# EAGLE design acnode (EAGLE 6.4)

## Sheet 1 of 3
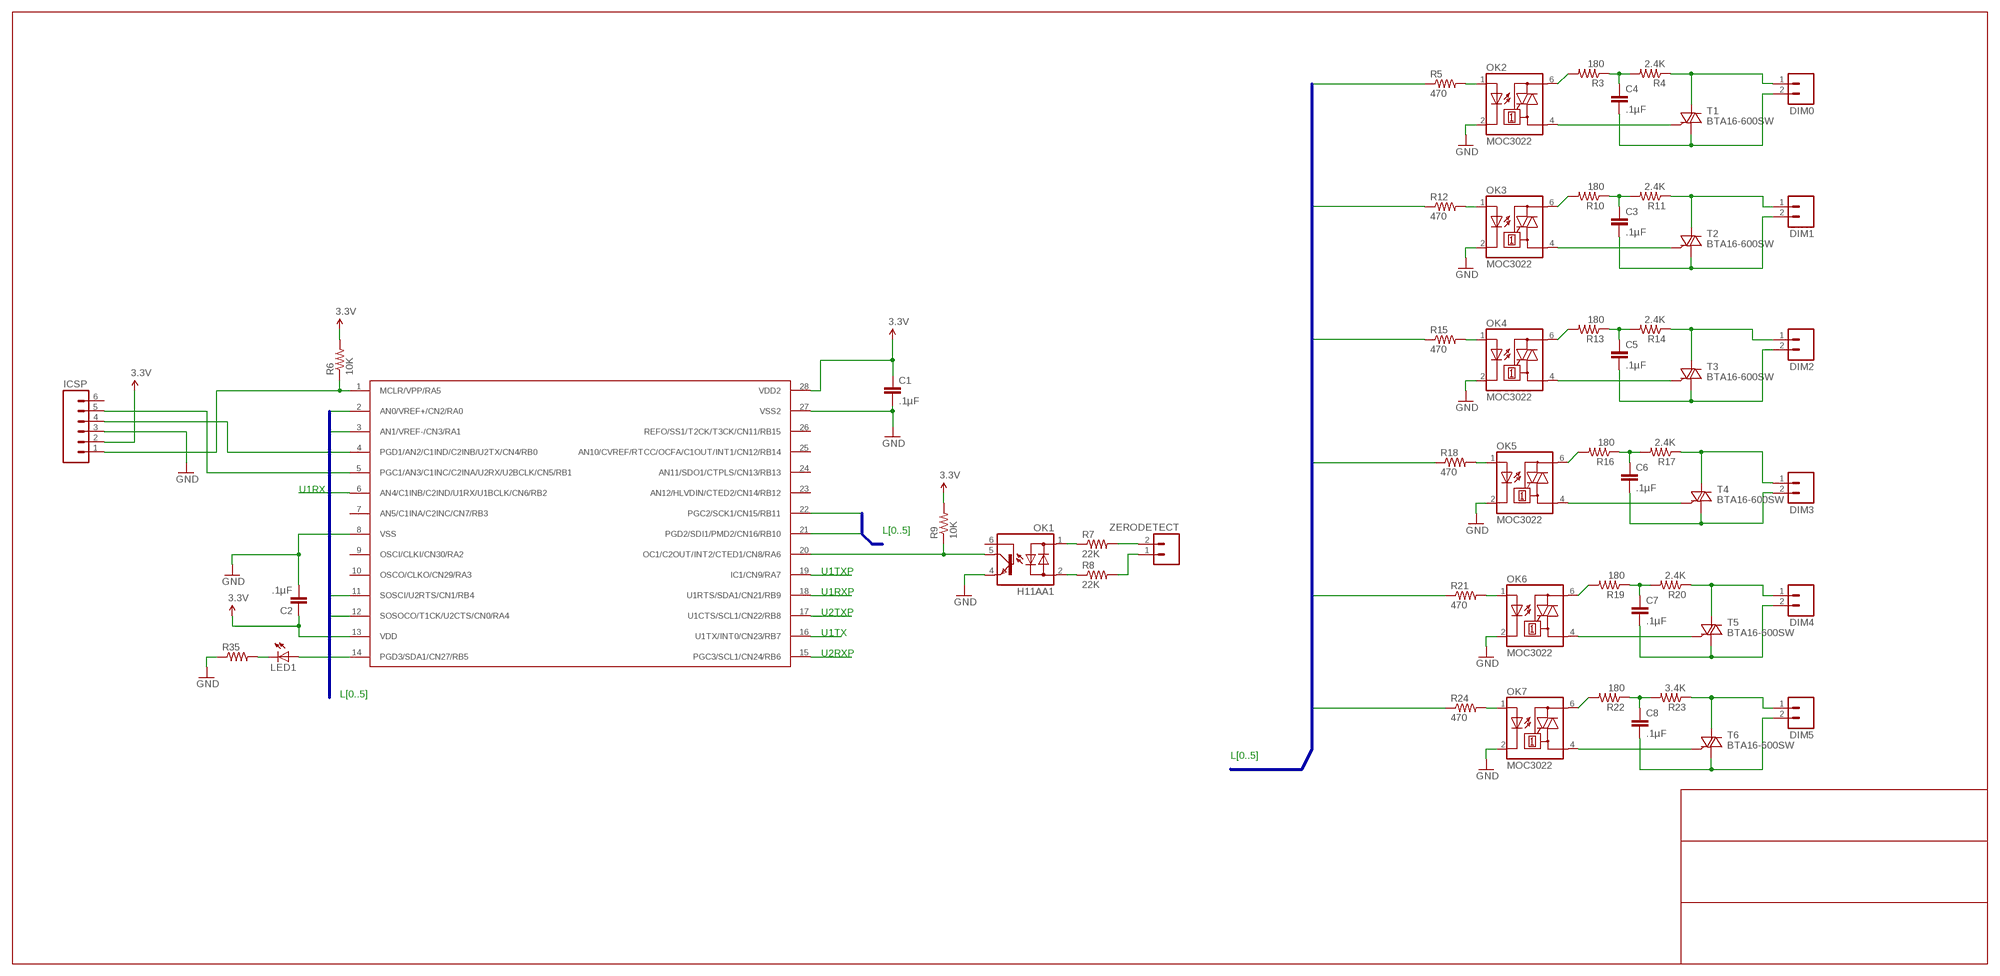
[diagram p0: schematic, sheet 1]

### Parts
C1  .1µF  CAP1206  [1206]
C2  .1µF  CAP1206  [1206]
C3  .1µF  CAPPTH1  [CAP-PTH-5MM]
C4  .1µF  CAPPTH1  [CAP-PTH-5MM]
C5  .1µF  CAPPTH1  [CAP-PTH-5MM]
C6  .1µF  CAPPTH1  [CAP-PTH-5MM]
C7  .1µF  CAPPTH1  [CAP-PTH-5MM]
C8  .1µF  CAPPTH1  [CAP-PTH-5MM]
DIM0  M025MM  [SCREWTERMINAL-5MM-2]
DIM1  M025MM  [SCREWTERMINAL-5MM-2]
DIM2  M025MM  [SCREWTERMINAL-5MM-2]
DIM3  M025MM  [SCREWTERMINAL-5MM-2]
DIM4  M025MM  [SCREWTERMINAL-5MM-2]
DIM5  M025MM  [SCREWTERMINAL-5MM-2]
ICSP  M06LOCK  [1X06_LOCK]
LED1  LEDCHIPLED_1206  [CHIPLED_1206]
OK1  H11AA1  IL250  [DIL06]
OK2  MOC3022  IL410  [DIL06]
OK3  MOC3022  IL410  [DIL06]
OK4  MOC3022  IL410  [DIL06]
OK5  MOC3022  IL410  [DIL06]
OK6  MOC3022  IL410  [DIL06]
OK7  MOC3022  IL410  [DIL06]
R3  180  RESISTORPTH-1/4W  [AXIAL-0.4]
R4  2.4K  RESISTORPTH-1/4W  [AXIAL-0.4]
R5  470  RESISTOR1206  [1206]
R6  10K  RESISTOR1206  [1206]
R7  22K  RESISTORPTH-1/4W  [AXIAL-0.4]
R8  22K  RESISTORPTH-1/4W  [AXIAL-0.4]
R9  10K  RESISTOR1206  [1206]
R10  180  RESISTORPTH-1/4W  [AXIAL-0.4]
R11  2.4K  RESISTORPTH-1/4W  [AXIAL-0.4]
R12  470  RESISTOR1206  [1206]
R13  180  RESISTORPTH-1/4W  [AXIAL-0.4]
R14  2.4K  RESISTORPTH-1/4W  [AXIAL-0.4]
R15  470  RESISTOR1206  [1206]
R16  180  RESISTORPTH-1/4W  [AXIAL-0.4]
R17  2.4K  RESISTORPTH-1/4W  [AXIAL-0.4]
R18  470  RESISTOR1206  [1206]
R19  180  RESISTORPTH-1/4W  [AXIAL-0.4]
R20  2.4K  RESISTORPTH-1/4W  [AXIAL-0.4]
R21  470  RESISTOR1206  [1206]
R22  180  RESISTORPTH-1/4W  [AXIAL-0.4]
R23  3.4K  RESISTORPTH-1/4W  [AXIAL-0.4]
R24  470  RESISTOR1206  [1206]
R35  RESISTOR1206  [1206]
T1  BTA16-600SW  BT138-V  [TO220BV]
T2  BTA16-600SW  BT138-V  [TO220BV]
T3  BTA16-600SW  BT138-V  [TO220BV]
T4  BTA16-600SW  BT138-V  [TO220BV]
T5  BTA16-600SW  BT138-V  [TO220BV]
T6  BTA16-600SW  BT138-V  [TO220BV]
U$2  PIC24F16KA102  PIC24F16KA102SSOP28DB  [SSOP28DB]
ZERODETECT  M025MM  [SCREWTERMINAL-5MM-2]

### Nets
3.3V: C1.1 C2.1 ICSP.2 R6.2 R9.2 U$2.13(VDD) U$2.28(VDD2) ; also sheet 3
GND: C1.2 C2.2 ICSP.3 OK1.4(E) OK2.2(C) OK3.2(C) OK4.2(C) OK5.2(C) OK6.2(C) OK7.2(C) R35.1 U$2.8(VSS) U$2.27(VSS2) ; also sheet 2,3
L0: R5.1 U$2.2(AN0/VREF+/CN2/RA0)
L1: R12.1 U$2.3(AN1/VREF-/CN3/RA1)
L2: R15.1 U$2.22(PGC2/SCK1/CN15/RB11)
L3: R18.1 U$2.21(PGD2/SDI1/PMD2/CN16/RB10)
L4: R21.1 U$2.11(SOSCI/U2RTS/CN1/RB4)
L5: R24.1 U$2.12(SOSOCO/T1CK/U2CTS/CN0/RA4)
N$1: LED1.A U$2.14(PGD3/SDA1/CN27/RB5)
N$2: OK3.4(A1) T2.G
N$3: ICSP.1 R6.1 U$2.1(MCLR/VPP/RA5)
N$4: LED1.C R35.2
N$9: OK2.4(A1) T1.G
N$10: OK2.6(A2) R3.P$2
N$11: C4.1 R3.P$1 R4.P$2
N$12 [power]: C4.2 DIM0.2 T1.T1(A1)
N$13 [power]: DIM0.1 R4.P$1 T1.T2(A2)
N$14: OK2.1(A) R5.2
N$17: OK1.1(AC1) R7.P$1
N$18: OK1.2(AC2) R8.P$1
N$19: OK1.5(C) R9.1 U$2.20(OC1/C2OUT/INT2/CTED1/CN8/RA6)
N$20: OK3.6(A2) R10.P$2
N$21: C3.1 R10.P$1 R11.P$2
N$22 [power]: C3.2 DIM1.2 T2.T1(A1)
N$23 [power]: DIM1.1 R11.P$1 T2.T2(A2)
N$24: OK3.1(A) R12.2
N$25: OK4.4(A1) T3.G
N$26: OK4.6(A2) R13.P$2
N$27: C5.1 R13.P$1 R14.P$2
N$28 [power]: C5.2 DIM2.2 T3.T1(A1)
N$29 [power]: DIM2.1 R14.P$1 T3.T2(A2)
N$30: OK4.1(A) R15.2
N$31: OK5.4(A1) T4.G
N$32: OK5.6(A2) R16.P$2
N$33: C6.1 R16.P$1 R17.P$2
N$34 [power]: C6.2 DIM3.2 T4.T1(A1)
N$35 [power]: DIM3.1 R17.P$1 T4.T2(A2)
N$36: OK5.1(A) R18.2
N$37: OK6.4(A1) T5.G
N$38: OK6.6(A2) R19.P$2
N$39: C7.1 R19.P$1 R20.P$2
N$40 [power]: C7.2 DIM4.2 T5.T1(A1)
N$41 [power]: DIM4.1 R20.P$1 T5.T2(A2)
N$42: OK6.1(A) R21.2
N$43: OK7.4(A1) T6.G
N$44: OK7.6(A2) R22.P$2
N$45: C8.1 R22.P$1 R23.P$2
N$46 [power]: C8.2 DIM5.2 T6.T1(A1)
N$47 [power]: DIM5.1 R23.P$1 T6.T2(A2)
N$48: OK7.1(A) R24.2
N$49: R7.P$2 ZERODETECT.2
N$50: R8.P$2 ZERODETECT.1
U1RX: U$2.6(AN4/C1INB/C2IND/U1RX/U1BCLK/CN6/RB2) ; also sheet 2
U1RXP: U$2.18(U1RTS/SDA1/CN21/RB9) ; also sheet 2
U1TX: U$2.16(U1TX/INT0/CN23/RB7) ; also sheet 2
U1TXP: U$2.19(IC1/CN9/RA7) ; also sheet 2
U2RX: ICSP.5 U$2.5(PGC1/AN3/C1INC/C2INA/U2RX/U2BCLK/CN5/RB1) ; also sheet 2
U2RXP: U$2.15(PGC3/SCL1/CN24/RB6) ; also sheet 2
U2TX: ICSP.4 U$2.4(PGD1/AN2/C1IND/C2INB/U2TX/CN4/RB0) ; also sheet 2
U2TXP: U$2.17(U1CTS/SCL1/CN22/RB8) ; also sheet 2
Unconnected: ICSP.6 OK1.6(B) U$2.7(AN5/C1INA/C2INC/CN7/RB3) U$2.9(OSCI/CLKI/CN30/RA2) U$2.10(OSCO/CLKO/CN29/RA3) U$2.23(AN12/HLVDIN/CTED2/CN14/RB12) U$2.24(AN11/SDO1/CTPLS/CN13/RB13) U$2.25(AN10/CVREF/RTCC/OCFA/C1OUT/INT1/CN12/RB14) U$2.26(REFO/SS1/T2CK/T3CK/CN11/RB15)

### Buses
L[0..5]

### Notes on the sheet
- U1RX
- L[0..5]
- U1TXP
- U1RXP
- U2TXP
- U1TX
- U2RXP
- L[0..5]
- L[0..5]

## Sheet 2 of 3
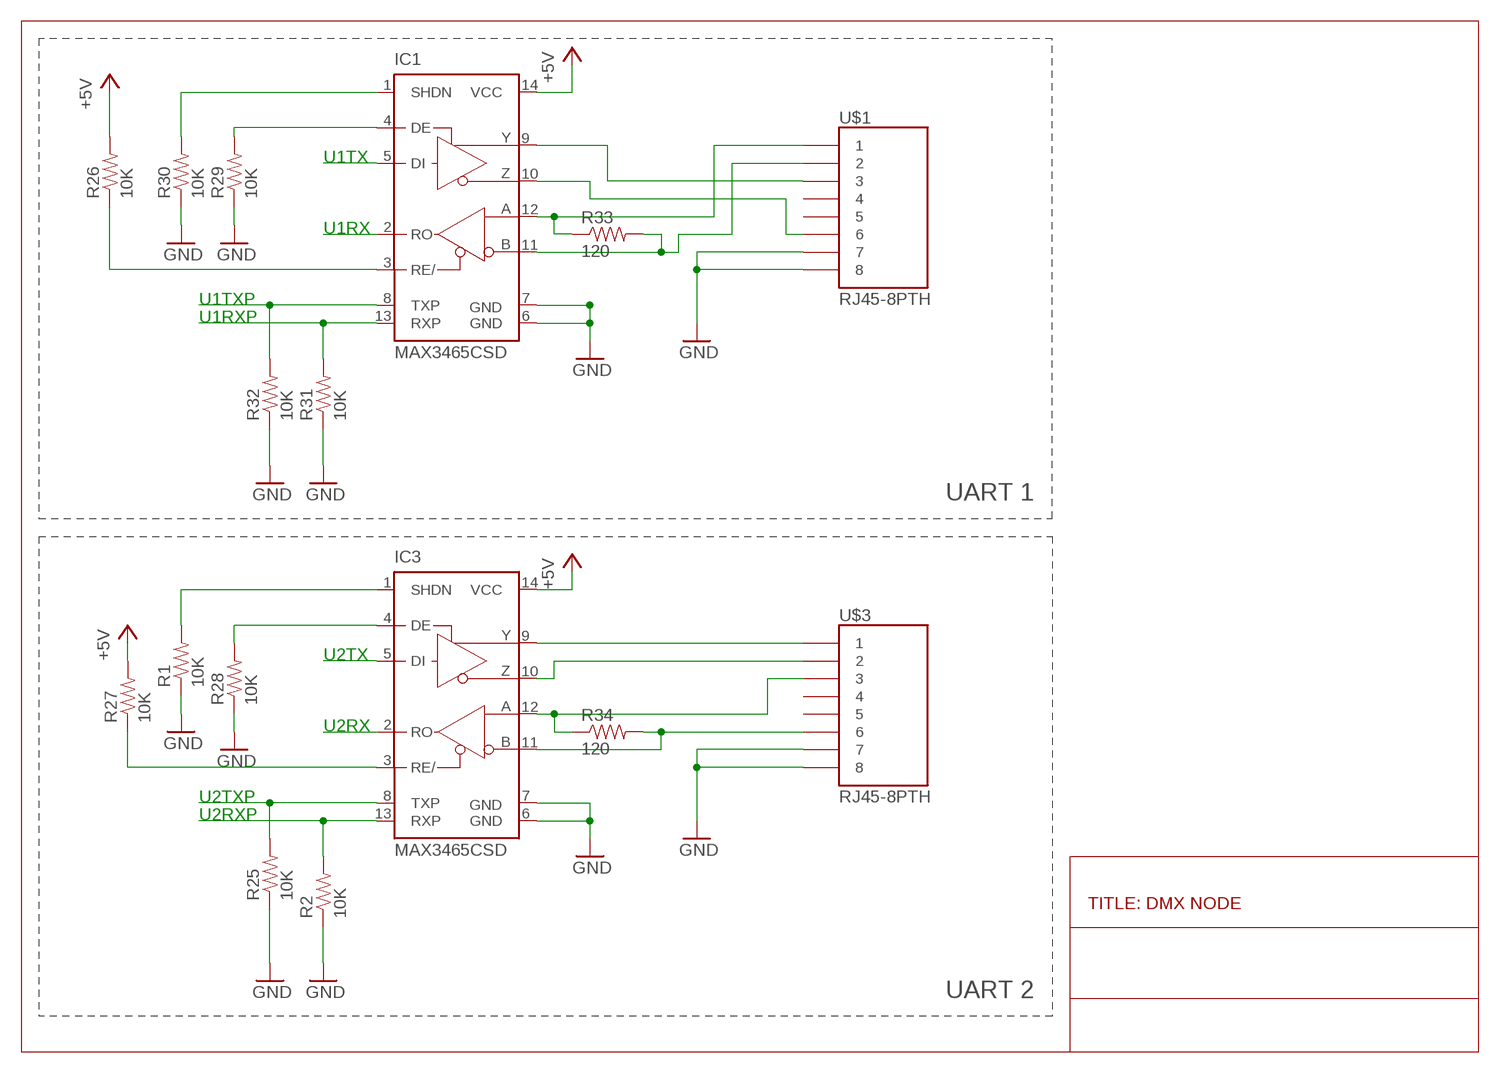
[diagram p1: schematic, sheet 2]

### Parts
IC1  MAX3465CSD  [SO14]
IC3  MAX3465CSD  [SO14]
R1  10K  RESISTOR1206  [1206]
R2  10K  RESISTOR1206  [1206]
R25  10K  RESISTOR1206  [1206]
R26  10K  RESISTOR1206  [1206]
R27  10K  RESISTOR1206  [1206]
R28  10K  RESISTOR1206  [1206]
R29  10K  RESISTOR1206  [1206]
R30  10K  RESISTOR1206  [1206]
R31  10K  RESISTOR1206  [1206]
R32  10K  RESISTOR1206  [1206]
R33  120  RESISTOR1206  [1206]
R34  120  RESISTOR1206  [1206]
U$1  RJ45-8PTH  [RJ45-8]
U$3  RJ45-8PTH  [RJ45-8]

### Nets
2A: IC3.12(A) R34.1 U$3.3
2A1: IC1.12(A) R33.1 U$1.1
2B: IC3.11(B) R34.2 U$3.6
2B1: IC1.11(B) R33.2 U$1.2
2Y: IC3.9(Y) U$3.1
2Y1: IC1.9(Y) U$1.3
2Z: IC3.10(Z) U$3.2
+5V: IC1.14(VCC) IC3.14(VCC) R26.2 R27.2 ; also sheet 3
GND: IC1.6(GND) IC1.7(GND) IC3.6(GND) IC3.7(GND) R1.1 R2.1 R25.1 R28.1 R29.1 R30.1 R31.1 R32.1 U$1.7 U$1.8 U$3.7 U$3.8 ; also sheet 1,3
N$6: IC3.1(SHDN) R1.2
N$8: IC1.4(DE) R29.2
N$15: IC1.3(RE/) R26.1
N$16: IC1.1(SHDN) R30.2
N$52: IC1.10(Z) U$1.6
N$59: IC3.4(DE) R28.2
N$60: IC3.3(RE/) R27.1
U1RX: IC1.2(RO) ; also sheet 1
U1RXP: IC1.13(RXP) R31.2 ; also sheet 1
U1TX: IC1.5(DI) ; also sheet 1
U1TXP: IC1.8(TXP) R32.2 ; also sheet 1
U2RX: IC3.2(RO) ; also sheet 1
U2RXP: IC3.13(RXP) R2.2 ; also sheet 1
U2TX: IC3.5(DI) ; also sheet 1
U2TXP: IC3.8(TXP) R25.2 ; also sheet 1
Unconnected: U$1.4 U$1.5 U$3.4 U$3.5

### Notes on the sheet
- U1TX
- U1RX
- U1TXP
- U1RXP
- UART 1
- U2TX
- U2RX
- U2TXP
- U2RXP
- TITLE: DMX NODE
- UART 2

## Sheet 3 of 3
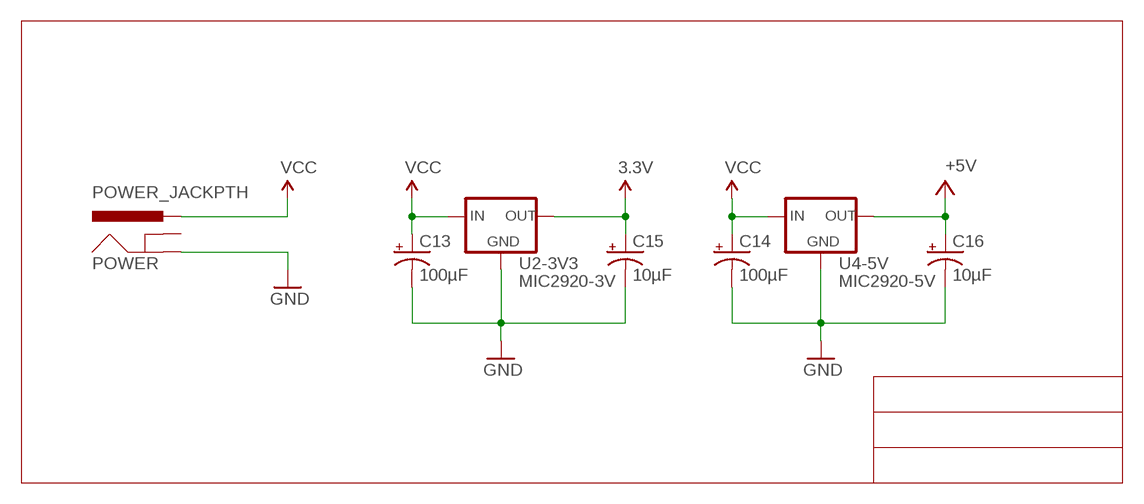
[diagram p2: schematic, sheet 3]

### Parts
C13  100µF  CAP_POLPTH1  [CPOL-RADIAL-100UF-25V]
C14  100µF  CAP_POLPTH1  [CPOL-RADIAL-100UF-25V]
C15  10µF  CAP_POLPTH2  [CPOL-RADIAL-10UF-25V]
C16  10µF  CAP_POLPTH2  [CPOL-RADIAL-10UF-25V]
POWER  POWER_JACKPTH  [POWER_JACK_PTH]
U2-3V3  MIC2920-3V  V_REG_MIC2920  [SOT223]
U4-5V  MIC2920-5V  V_REG_MIC2920  [SOT223]

### Nets
3.3V: C15.1(+) U2-3V3.3(OUT) ; also sheet 1
+5V: C16.1(+) U4-5V.3(OUT) ; also sheet 2
GND: C13.2(-) C14.2(-) C15.2(-) C16.2(-) POWER.GND U2-3V3.2(GND) U4-5V.2(GND) ; also sheet 1,2
VCC: C13.1(+) C14.1(+) POWER.PWR U2-3V3.1(IN) U4-5V.1(IN)
Unconnected: POWER.GNDBREAK

## Library data of the parts
C1-C8 = SparkFun:CAP: Capacitor Standard 0603 ceramic capacitor, and 0.1" leaded capacitor.
C13-C16 = SparkFun:CAP_POL: Capacitor Polarized These are standard SMD and PTH capacitors. Normally 10uF, 47uF, and 100uF in electrolytic and tantalum varieties. Always verify the external diameter of the through hole cap, it varies with capacity, voltage, and manufacturer. The EIA devices should be standard.
DIM0 DIM1-DIM5 ZERODETECT = SparkFun:M02: Header 2 Standard 2-pin 0.1" header. Use with straight break away headers (SKU : PRT-00116), right angle break away headers (PRT-00553), swiss pins (PRT-00743), machine pins (PRT-00117), and female headers (PRT-00115). Molex polarized connector foot print use with SKU : PRT-08233 with associated crimp pins and housings.
IC1 IC3 = maxim:MAX346*: +5V, Fail-Safe, 40Mbps, Profibus RS-485/RS-422 Transceivers Source: MAX3465-MAX3469.pdf
ICSP = SparkFun:M06: Header 6 Standard 6-pin 0.1" header. Use with straight break away headers (SKU : PRT-00116), right angle break away headers (PRT-00553), swiss pins (PRT-00743), machine pins (PRT-00117), and female headers (PRT-00115). Molex polarized connector foot print use with SKU : PRT-08094 with associated crimp pins and housings. NOTES ON THE VARIANTS LOCK and LOCK_LONGPADS... This footprint was designed to help hold the alignment of a through-hole component (i.e. 6-pin header) while soldering it into place. You may notice that each hole has been shifted either up or down by 0.005 of an inch from it's more standard position (which is a perfectly straight line). This slight alteration caused the pins (the squares in the middle) to touch the edges of the holes. Because they are alternating, it causes a "brace" to hold the component in place. 0.005 has proven to be the perfect amount of "off-center" position when using our standard breakaway headers. Although looks a little odd when you look at the bare footprint, once you have a header in there, the alteration is very hard to notice. Also, if you push a header all the way into place, it is covered up entirely on the bottom side. This idea of altering the position of holes to aid alignment will be further integrated into the Sparkfun Library for other footprints. It can help hold any component with 3 or more connection pins.
LED1 = led:LED: LED OSRAM: - CHIPLED LG R971, LG N971, LY N971, LG Q971, LY Q971, LO R971, LY R971 LH N974, LH R974 LS Q976, LO Q976, LY Q976 LO Q996 - Hyper CHIPLED LW Q18S LB Q993, LB Q99A, LB R99A - SideLED LS A670, LO A670, LY A670, LG A670, LP A670 LB A673, LV A673, LT A673, LW A673 LH A674 LY A675 LS A676, LA A676, LO A676, LY A676, LW A676 LS A679, LY A679, LG A679 - Hyper Micro SIDELED® LS Y876, LA Y876, LO Y876, LY Y876 LT Y87S - SmartLED LW L88C, LW L88S LB L89C, LB L89S, LG L890 LS L89K, LO L89K, LY L89K LS L896, LA L896, LO L896, LY L896 - TOPLED LS T670, LO T670, LY T670, LG T670, LP T670 LSG T670, LSP T670, LSY T670, LOP T670, LYG T670 LG T671, LOG T671, LSG T671 LB T673, LV T673, LT T673, LW T673 LH T674 LS T676, LA T676, LO T676, LY T676, LB T676, LH T676, LSB T676, LW T676 LB T67C, LV T67C, LT T67C, LS T67K, LO T67K, LY T67K, LW E67C LS E67B, LA E67B, LO E67B, LY E67B, LB E67C, LV E67C, LT E67C LW T67C LS T679, LY T679, LG T679 LS T770, LO T770, LY T770, LG T770, LP T770 LB T773, LV T773, LT T773, LW T773 LH T774 LS E675, LA E675, LY E675, LS T675 LS T776, LA T776, LO T776, LY T776, LB T776 LHGB T686 LT T68C, LB T68C - Hyper Mini TOPLED® LB M676 - Mini TOPLED Santana® LG M470 LS M47K, LO M47K, LY M47K Source: http://www.osram.convergy.de LUXEON: - LUMILED® LXK2-PW12-R00, LXK2-PW12-S00, LXK2-PW14-U00, LXK2-PW14-V00 LXK2-PM12-R00, LXK2-PM12-S00, LXK2-PM14-U00 LXK2-PE12-Q00, LXK2-PE12-R00, LXK2-PE12-S00, LXK2-PE14-T00, LXK2-PE14-U00 LXK2-PB12-K00, LXK2-PB12-L00, LXK2-PB12-M00, LXK2-PB14-N00, LXK2-PB14-P00, LXK2-PB14-Q00 LXK2-PR12-L00, LXK2-PR12-M00, LXK2-PR14-Q00, LXK2-PR14-R00 LXK2-PD12-Q00, LXK2-PD12-R00, LXK2-PD12-S00 LXK2-PH12-R00, LXK2-PH12-S00 LXK2-PL12-P00, LXK2-PL12-Q00, LXK2-PL12-R00 Source: www.luxeon.com KINGBRIGHT: KA-3528ASYC Source: www.kingbright.com
OK1 = optocoupler:IL250: SIEMENS OPTO COUPLER
OK2-OK7 = optocoupler:IL410: SIEMENS OPTO COUPLER
POWER = SparkFun:POWER_JACK: Power Jack This is the standard 5.5mm barrel jack for power. The PTH is the most common, proven, reliable, footprint. All others are experimental. The Slot footprint only works if the mill layer is transmitted to the PCB fab house so be warned. Spark Fun Electronics SKU : PRT-00119. Mating wall wart : TOL-00298 (and others)
R1-R35 = SparkFun:RESISTOR: Resistor Basic schematic elements and footprints for 0603, 1206, and PTH resistors.
T1-T6 = triac:BT138: TRIAC Source: http://www.semiconductors.philips.com BT138_SERIES_2.pdf
U2-3V3 U4-5V = SparkFun:V_REG_MIC2920: MIC2920A (http://www.micrel.com/_PDF/mic2920.pdf) - 400mA output LDO Regulator
U$1 U$3 = SparkFun:RJ45-8: RJ45 Jack Simple RJ45, 8-pin connection - connector for common Cat5, Cat5e, and Cat6 Ethernet cables. Footprint not yet proven in production. Connector sku is PRT-00643; Breakout PCB sku is BOB-00716.
U$2 = custom:PIC24F16KA102: 20/28-Pin General Purpose, 16-Bit Flash Microcontrollers with nanoWatt XLP? Technology

## Net classes
0 default: width 0.406 mm
1 ground: width 2 mm
2 power: width 2 mm

## Board
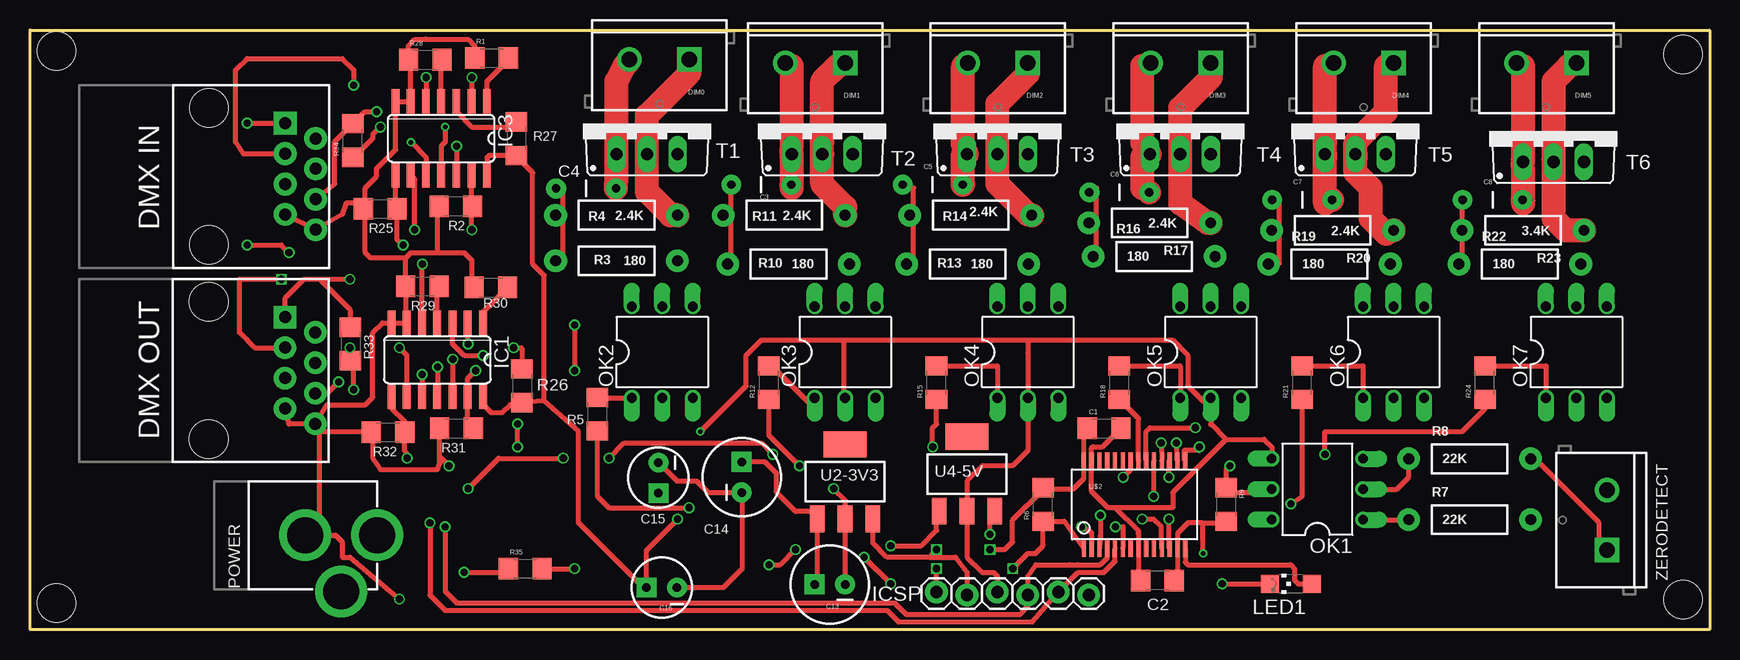
[diagram p3: board, top side]
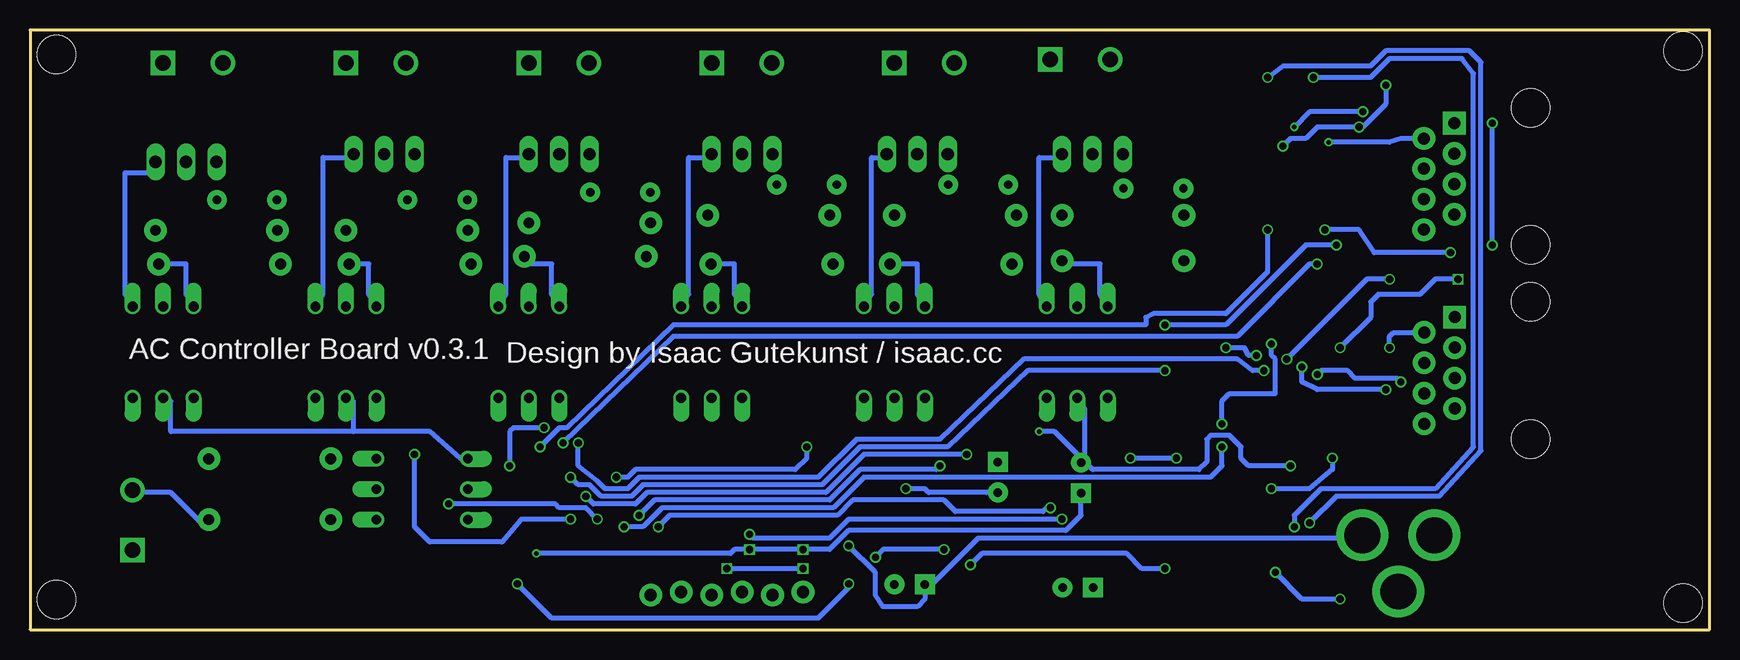
[diagram p4: board, bottom side, seen from below]

Size 140 x 50 mm. Coordinates in mm from the lower left corner, seen from the top.
Outline: 0,50 140,50 140,0 0,0 0,50
Copper layers (1*16): Top 0.035mm / dielectric 1.5mm / Bottom 0.035mm
Design rules "Fusion_eagle_rule_v1.1": minimum track width 6mil, minimum drill 12mil, track to track 6mil, track to pad 6mil, pad to pad 6mil, via to via 6mil, smd to smd 0mil, copper to edge 10mil, drill to drill 10mil, minimum pad ring 10mil, minimum via ring 6mil, stop-mask expansion 2mil, vias tented up to drill 100mil, thermal gap 10mil
Holes 3.2 mm at 2.22,2.22 2.22,48.26 137.79,47.94 137.79,2.49

### Footprints (pad centres in the part's own frame; a part is rotated, then mirrored left to right if it is on the bottom)
1206 = smd 1.6 x 1.8: 1 -1.4,0; 2 1.4,0
CAP-PTH-5MM = drill 0.7 pad 1.651: 1 -2.5,0; 2 2.5,0
CPOL-RADIAL-100UF-25V = drill 0.7 pad 1.651 square: 1 1.27,0 | drill 0.7 pad 1.651: 2 -1.27,0
CPOL-RADIAL-10UF-25V = drill 0.7 pad 1.651 square: 1 1.27,0 | drill 0.7 pad 1.651: 2 -1.27,0
SCREWTERMINAL-5MM-2 = drill 1.3 pad 2.032 square: 1 0,0 | drill 1.3 pad 2.032: 2 5,0
SO14 = smd 0.66 x 2.032: 1 -3.81,-3.073; 2 -2.54,-3.073; 3 -1.27,-3.073; 4 0,-3.073; 5 1.27,-3.073; 6 2.54,-3.073; 7 3.81,-3.073; 8 3.81,3.073; 9 2.54,3.073; 10 1.27,3.073; 11 0,3.073; 12 -1.27,3.073; 13 -2.54,3.073; 14 -3.81,3.073
1X06_LOCK = drill 1.016 pad 1.88: 1 0,0; 2 2.54,-0.254; 3 5.08,0; 4 7.62,-0.254; 5 10.16,0; 6 12.7,-0.254
CHIPLED_1206 = smd 1.5 x 1.5: A 0,-1.75; C 0,1.75
DIL06 = drill 0.813 offset: 1 -2.54,-3.81; 2 0,-3.81; 3 2.54,-3.81; 4 2.54,3.81; 5 0,3.81; 6 -2.54,3.81
POWER_JACK_PTH = drill 2.997 pad 4.318: GND 0,7.7; GNDBREAK 4.7,10.7; PWR 0,13.7
AXIAL-0.4 = drill 0.9 pad 1.88: P$1 -5.08,0; P$2 5.08,0
TO220BV = drill 1.016 long: G 2.54,-2.54; T1 -2.54,-2.54; T2 0,-2.54
SOT223 = smd 1.219 x 2.235: 1 -2.311,-3.099; 2 0,-3.099; 3 2.311,-3.099 | smd 3.6 x 2.2: 4 0,3.099
RJ45-8 = drill 1 pad 1.88 square: 1 -4.445,6.35 | drill 1 pad 1.88: 2 -3.175,8.89; 3 -1.905,6.35; 4 -0.635,8.89; 5 0.635,6.35; 6 1.905,8.89; 7 3.175,6.35; 8 4.445,8.89 | hole 3.2: -5.715,0; 5.715,0
SSOP28DB = smd 0.348 x 1.397: 1 -4.225,-3.656; 2 -3.575,-3.656; 3 -2.925,-3.656; 4 -2.275,-3.656; 5 -1.625,-3.656; 6 -0.975,-3.656; 7 -0.325,-3.656; 8 0.325,-3.656; 9 0.975,-3.656; 10 1.625,-3.656; 11 2.275,-3.656; 12 2.925,-3.656; 13 3.575,-3.656; 14 4.225,-3.656; 15 4.225,3.656; 16 3.575,3.656; 17 2.925,3.656; 18 2.275,3.656; 19 1.625,3.656; 20 0.975,3.656; 21 0.325,3.656; 22 -0.325,3.656; 23 -0.975,3.656; 24 -1.625,3.656; 25 -2.275,3.656; 26 -2.925,3.656; 27 -3.575,3.656; 28 -4.225,3.656

### Placement (x,y rotation side)
C1  89.53,16.78 0 top
C2  93.98,4.08 180 top
C3  60.96,37.1 0 top
C4  46.35,36.78 0 top
C5  75.25,37.1 0 top
C6  90.8,36.47 0 top
C7  106.04,35.83 0 top
C8  121.92,35.83 0 top
C13  66.67,3.76 180 top
C14  59.33,12.7 90 top
C15  52.38,12.65 270 top
C16  52.66,3.5 180 top
DIM0  54.97,47.53 180 top
DIM1  67.94,47.26 180 top
DIM2  83.18,47.26 180 top
DIM3  98.42,47.26 180 top
DIM4  113.66,47.26 180 top
DIM5  128.9,47.26 180 top
IC1  33.95,22.5 180 top
IC3  34.27,40.95 180 top
ICSP  75.56,3.13 0 top
LED1  105.09,3.81 90 top
OK1  107.31,11.7 90 top
OK2  52.7,23.13 0 top
OK3  67.94,23.13 0 top
OK4  83.18,23.13 0 top
OK5  98.42,23.13 0 top
OK6  113.66,23.13 0 top
OK7  128.9,23.13 0 top
POWER  15.23,7.87 270 top
R1  38.48,47.67 0 top
R2  35.5,35.31 0 top
R3  48.89,30.75 0 top
R4  48.89,34.56 180 top
R5  47.3,17.95 90 top
R6  84.45,10.43 90 top
R7  120.01,9.16 0 top
R8  120.01,14.24 0 top
R9  99.69,10.43 270 top
R10  63.23,30.48 0 top
R11  62.86,34.56 180 top
R12  61.59,20.59 90 top
R13  78.15,30.48 0 top
R14  78.42,34.56 180 top
R15  75.56,20.59 90 top
R16  93.71,31.11 0 top
R17  93.34,33.92 180 top
R18  90.8,20.59 90 top
R19  108.31,30.48 0 top
R20  108.58,33.29 180 top
R21  106.04,20.59 90 top
R22  124.19,30.48 0 top
R23  124.46,33.29 180 top
R24  121.28,20.59 90 top
R25  29.2,35.09 0 top
R26  41.01,20.32 270 top
R27  40.55,40.93 270 top
R28  32.95,47.52 0 top
R29  32.7,28.62 0 top
R30  38.41,28.53 0 top
R31  35.56,16.78 0 top
R32  29.84,16.46 0 top
R33  26.72,23.81 270 top
R34  26.91,40.78 90 top
R35  41.27,5.08 0 top
T1  51.43,42.18 0 top
T2  66.04,42.18 0 top
T3  80.64,42.18 0 top
T4  95.88,42.18 0 top
T5  110.49,42.18 0 top
T6  127,41.55 0 top
U2-3V3  67.94,12.34 0 top
U4-5V  78.1,12.97 0 top
U$1  14.9,21.6 270 top
U$2  92.07,10.43 0 top
U$3  14.92,37.78 270 top
ZERODETECT  131.44,6.62 90 top

### Tracks (layer width: path | path; a pad name or v marks a point on that pad's centre or on a via)
2A  (via drill 0.6)
  Top 0.406: IC3.12 35.56,37.9 v35.56,40.32 | v29.21,41.91 28.57,41.27 28.57,40.96 27,39.38 R34.1 26.99,39.46 26.99,39.69 | v26.99,45.4 26.99,46.67 26.04,47.62 18.1,47.62 17.14,46.67 17.14,40.64 17.78,39.69 U$3.3
  Bottom 0.406: v35.56,40.32 34.92,40.96 33.66,40.96 32.7,41.91 v29.21,41.91 28.89,41.91 26.99,43.81 v26.99,45.4
2A1  (via drill 0.6)
  Top 0.406: 24.13,29.21 26.67,26.67 26.67,25.4 R33.1 | 24.13,29.21 22.86,29.21 21.29,27.64 U$1.1 | IC1.12 35.24,19.76 v35.24,22.54 | 24.13,29.21 v26.67,29.21
  Bottom 0.406: v35.24,22.54 28.57,29.21 v26.67,29.21
2B  (via drill 0.38, 0.6)
  Top 0.406: v34.61,41.91 34.61,40.64 34.29,40.32 34.29,38.1 IC3.11 | v28.89,43.18 27.91,43.18 R34.2 25.4,40.67 25.4,37.15 U$3.6
  Bottom 0.406: v34.61,41.91 33.34,43.18 v28.89,43.18
2B1  (via drill 0.6)
  Top 0.406: v26.99,20 26.99,22.14 R33.2 v26.67,23.5 | v33.97,21.91 33.97,19.44 IC1.11
  Bottom 0.406: v26.99,20 32.7,20 33.97,20.64 v33.97,21.91 | U$1.2 26.35,24.77 26.67,24.45 v26.67,23.5
2Y  (via drill 0.6)
  Top 0.406: v18.1,42.23 U$3.1 | v18.1,32.07 20.95,32.07 v21.59,31.43 | v32.07,33.34 32.07,37.55 IC3.9
  Bottom 0.406: v18.1,32.07 v18.1,42.23 | v21.59,31.43 27.94,31.43 29.21,33.34 v32.07,33.34
2Y1  (via drill 0.6)
  Top 0.406: v30.8,23.5 31.41,22.88 IC1.9 | v20.95,29.21 17.46,29.21 17.46,24.77 18.73,23.5 20.92,23.5 U$1.3
  Bottom 0.406: v30.8,23.5 28.25,26.04 28.25,27.32 27.62,27.94 24.13,27.94 22.86,29.21 v20.95,29.21
2Z  (via drill 0.38)
  Top 0.406: v31.75,40.64 33.02,39.37 33.02,38.1 IC3.10
  Bottom 0.406: v31.75,40.64 26.67,40.64 25.72,40.96 U$3.2
3.3V  (via drill 0.38, 0.6)
  Top 0.406: C2.1 95.65,4.35 U$2.13 95.65,8.02 96.52,8.89 97.79,8.89 | 84.53,11.75 R6.2 | 84.53,11.75 87,11.75 87.85,12.6 U$2.28 87.85,16.5 C1.1 | R9.2 99.55,8.89 97.79,8.89 | ICSP.2 78.11,4.78 78.11,4.76 77.15,6.03 74.93,6.03 | 74.93,6.03 71.44,6.03 70.25,7.22 U2-3V3.3 | 84.53,11.75 81.92,9.13 81.92,7.3 81.28,6.67 v80.01,6.67 | v75.56,6.67 74.93,6.03 | v97.79,6.35 97.79,8.89
  Bottom 0.406: v97.79,6.35 81.6,6.35 81.28,6.67 v80.01,6.67 v75.56,6.67 73.34,6.67 71.75,8.26 53.66,8.26 52.39,9.53 52.39,11.06 52.38,11.06 C15.1
+5V  (via drill 0.6)
  Top 0.406: U4-5V.3 80.01,9.47 v80.01,7.94 | v53.98,9.21 51.39,6.62 C16.1 50.8,3.81 45.72,8.89 45.72,16.51 42.86,19.05 | 42.86,19.05 42.86,29.53 41.91,30.48 41.91,38.1 40.64,39.37 R27.2 38.26,39.53 38.1,39.37 38.1,37.9 IC3.14 | 42.86,19.05 41.6,18.96 | 41.6,18.96 R26.2 | IC1.14 37.76,18.75 38.42,18.1 39.37,18.1 40.01,18.73 41.37,18.73 41.6,18.96
  Bottom 0.406: v80.01,7.94 79.69,7.62 73.34,7.62 71.75,9.21 v53.98,9.21
GND  (via drill 0.38, 0.6)
  Top 0.406: 99.69,15.88 98.42,17.14 98.42,17.09 OK5.2 97.79,19.05 96.52,20.32 96.52,22.86 95.25,24.13 83.19,24.13 | 99.69,15.88 102.87,15.88 103.5,15.24 103.55,14.24 OK1.4 | C2.2 92.4,4.26 U$2.8 92.39,8.05 92.39,8.26 90.49,10.16 | C1.2 89.39,15.24 88.58,15.24 88.5,15.15 U$2.27 88.5,11.52 89.85,10.16 90.49,10.16 | ICSP.3 80.64,4.45 80.33,4.76 79.38,4.76 78.11,6.03 U4-5V.2 | C13.2 U2-3V3.2 67.94,9.21 67.94,9.53 67.94,10.79 v66.99,11.75 | U4-5V.2 | U4-5V.2 78.11,12.38 79.38,13.65 81.92,13.65 83.18,14.92 OK4.2 83.18,23.05 83.19,23.05 83.19,24.13 | C15.2 53.92,12.38 55.56,12.38 56.51,11.43 C14.2 59.37,11.38 59.37,5.08 57.79,3.5 C16.2 | 27.94,35.56 26.35,35.56 26.04,34.61 U$3.8 U$3.7 | 27.94,35.56 R25.1 27.94,34.29 | 90.49,10.16 95.25,10.16 95.25,11.43 99.69,15.88 | 24.13,16.51 27.62,16.51 R32.1 28.57,16.33 28.57,14.29 29.21,13.34 33.97,13.34 34.16,13.84 34.16,14.42 | 24.13,16.51 24.13,17.78 U$1.8 | U$1.7 21.59,17.14 U$1.8 | 24.13,16.51 24.13,8.89 POWER.GND 25.47,7.87 26.04,7.3 26.04,6.03 26.67,6.03 v30.8,2.54 | U$1.8 24.73,18.73 27.94,18.73 28.57,19.37 28.57,24.77 29.38,25.57 IC1.7 IC1.6 31.3,28.53 R29.1 31.3,30.99 | 32.7,49.21 33.02,49.23 | 32.7,49.21 36.51,49.21 37.08,48.65 R1.1 | R30.1 36.83,28.71 36.83,30.8 36.2,31.43 33.97,31.43 | 33.97,31.43 31.75,31.43 31.3,30.99 | R2.1 33.97,35.18 33.97,31.43 | 27.94,34.29 27.94,31.43 28.39,30.99 31.3,30.99 | 27.94,34.29 27.94,35.26 | OK3.2 67.82,19.45 67.82,24.13 | 67.82,24.13 83.19,24.13 | v55.88,16.51 59.69,20.32 59.69,22.86 60.96,24.13 67.82,24.13 | 32.7,49.21 32.07,49.21 31.55,48.7 R28.1 31.71,46.97 IC3.6 IC3.7 30.48,44.01 30.48,40.01 28.89,38.42 28.89,37.78 27.94,36.83 27.94,35.56
  Top 0.406: 34.16,14.42 v34.92,13.65 | 34.16,14.42 R31.1 | v36.2,4.76 39.56,4.76 R35.1
  Bottom 0.406: v66.99,11.75 65.41,11.75 65.09,11.43 60.28,11.43 C14.2 | 52.07,13.97 52.07,18.41 OK2.2 | 113.03,16.51 113.03,19.05 OK6.2 | 113.03,16.51 106.68,16.51 104.14,14.29 OK1.4 | 113.03,16.51 128.27,16.51 128.27,19.05 OK7.2 | 52.07,13.97 54.61,16.51 v55.88,16.51 | 52.07,13.97 C15.2 | 52.07,13.97 51.44,13.34 42.55,13.34 41.91,13.97 41.91,15.88 41.59,16.19 40.01,16.19 39.05,15.24 39.05,14.29 38.42,13.65 v34.92,13.65 | v30.8,2.54 33.97,2.54 v36.2,4.76
L0  (via drill 0.6)
  Top 0.406: v87.63,8.57 88.27,8.26 88.27,8.28 88.5,8.04 U$2.2 | v54.93,10.16 48.26,10.16 47.3,11.12 R5.1
  Bottom 0.406: v87.63,8.57 86.68,9.53 72.71,9.53 71.44,10.79 63.82,10.79 62.87,9.84 55.56,9.84 55.24,10.16 v54.93,10.16
L1  (via drill 0.6)
  Top 0.406: U$2.3 89.22,7.8 v89.22,9.53 | v64.14,13.65 61.59,16.2 R12.1
  Bottom 0.406: v89.22,9.53 87.95,10.79 73.34,10.79 70.8,13.34 64.45,13.34 v64.14,13.65
L2  (via drill 0.6)
  Top 0.406: U$2.22 91.76,14.08 91.76,13.34 v91.12,12.7 | v75.25,15.24 75.25,16.83 75.56,17.14 R15.1
  Bottom 0.406: v91.12,12.7 90.17,12.7 89.53,13.34 76.2,13.34 75.25,14.29 v75.25,15.24
L3
  Top 0.406: R18.1 92.4,17.59 U$2.21
L4  (via drill 0.6)
  Top 0.406: U$2.11 94.3,8.41 94.3,8.57 93.66,9.21 v92.71,9.21 | v105.09,10.48 106.04,11.11 R21.1
  Bottom 0.406: v92.71,9.21 93.66,10.16 95.89,10.16 96.2,10.48 v105.09,10.48
L5  (via drill 0.6)
  Top 0.406: U$2.12 94.93,6.84 v94.93,9.21 | v107.95,14.61 107.95,16.51 119.38,16.51 121.28,18.41 R24.1
  Bottom 0.406: v94.93,9.21 99.06,9.21 100.65,7.3 106.68,7.3 107.95,8.57 v107.95,14.61
N$1
  Top 0.406: LED1.A 105.73,3.81 105.41,4.13 105.41,5.08 105.09,5.4 96.52,5.4 96.3,5.62 U$2.14
N$2
  Bottom 0.406: OK3.4 69.85,27.94 69.85,39.37 68.58,39.37 T2.G
N$3  (via drill 0.6)
  Top 0.406: U$2.1 87,7.94 86.22,9.03 R6.1 84.45,6.98 83.82,6.35 83.19,6.35 v81.92,5.08 | ICSP.1 v75.56,5.08
  Bottom 0.406: v75.56,5.08 v81.92,5.08
N$4  (via drill 0.6)
  Top 0.406: R35.2 v45.4,5.08 | v61.59,5.4 62.55,5.4 v63.82,6.67 | v69.53,6.03 v71.75,3.81 | v99.38,3.81 LED1.C
  Bottom 0.406: v45.4,5.08 47.31,5.08 48.58,6.35 60.64,6.35 v61.59,5.4 | v63.82,6.67 68.9,6.67 v69.53,6.03 | v71.75,3.81 71.75,3.49 74.3,0.95 96.52,0.95 v99.38,3.81
N$6
  Top 0.406: R1.2 39.37,46.99 38.1,45.72 38.1,44.77 IC3.1
N$8
  Top 0.406: R29.2 33.95,28.47 IC1.4
N$9
  Bottom 0.406: OK2.4 55.88,27.94 55.88,39.37 54.61,39.37 T1.G
N$10
  Bottom 0.406: OK2.6 50.8,27.94 50.8,30.48 53.34,30.48 R3.P$2
N$11
  Top 0.406: 44.45,34.29 44.45,36.83 C4.1 | 44.45,34.29 44.45,30.48 R3.P$1 | 44.45,34.29 R4.P$2
N$12
  Top 2: C4.2 48.9,37.78 48.9,39.69 T1.T1 48.9,40.64 48.9,45.72 49.53,46.99 DIM0.2
N$13
  Top 2: T1.T2 | T1.T2 51.44,42.86 54.97,46.4 DIM0.1 | T1.T2 51.44,36.51 53.39,34.56 R4.P$1
N$14
  Top 0.406: R5.2 47.34,19.32 OK2.1
N$15  (via drill 0.6)
  Top 0.406: v37.78,22.86 36.2,22.86 35.22,23.83 IC1.3 | v40.32,23.5 40.96,23.5 41.01,23.45 R26.1
  Bottom 0.406: v40.32,23.5 38.73,23.5 38.42,22.86 v37.78,22.86
N$16
  Top 0.406: R30.2 37.76,26.48 IC1.1
N$17
  Top 0.406: OK1.1 R7.P$1
N$18
  Top 0.406: R8.P$1 114.94,12.7 113.94,11.7 OK1.2
N$19  (via drill 0.6)
  Top 0.406: OK1.5 102.87,11.43 100.33,11.43 R9.1 99.69,13.33 v100.01,13.65 | U$2.20 93.03,14.11 93.03,16.51 93.34,16.83 v97.16,16.83
  Bottom 0.406: v97.16,16.83 99.69,16.83 100.01,16.51 v100.01,13.65
N$20
  Bottom 0.406: OK3.6 66.04,27.94 66.04,30.48 68.58,30.48 R10.P$2
N$21
  Top 0.406: 58.42,34.29 58.42,36.83 C3.1 | 58.42,34.29 58.42,30.48 R10.P$1 | 58.42,34.29 R11.P$2
N$22
  Top 2: C3.2 63.5,36.83 63.5,39.37 T2.T1 63.5,40.64 63.5,46.99 DIM1.2
N$23
  Top 2: DIM1.1 67.31,46.99 66.04,45.72 66.04,40.64 T2.T2 66.04,37.15 67.94,35.24 R11.P$1
N$24
  Top 0.406: R12.2 62.23,21.59 64.77,19.05 OK3.1
N$25
  Bottom 0.406: OK4.4 85.09,27.94 85.09,39.37 83.82,39.37 T3.G
N$26
  Bottom 0.406: OK4.6 81.28,27.94 81.28,30.48 82.55,30.48 R13.P$2
N$27
  Top 0.406: 73.66,34.29 73.66,36.83 C5.1 | 73.66,34.29 73.66,30.48 R13.P$1 | 73.66,34.29 R14.P$2
N$28
  Top 2: C5.2 77.79,37.15 77.79,39.69 T3.T1 77.79,40.32 77.79,46.99 DIM2.2
N$29
  Top 2: 83.55,34.56 R14.P$1 83.18,34.61 80.64,37.15 T3.T2 80.64,43.81 83.18,46.35 DIM2.1
N$30
  Top 0.406: R15.2 80.64,21.99 OK4.1
N$31
  Bottom 0.406: OK5.4 100.33,27.94 100.33,39.37 99.06,39.37 T4.G
N$32
  Bottom 0.406: OK5.6 96.52,27.94 96.52,30.48 99.06,30.48 R16.P$2
N$33
  Top 0.406: 88.9,34.29 88.9,36.83 C6.1 | 88.9,34.29 88.9,31.75 R16.P$1 | 88.9,34.29 R17.P$2
N$34
  Top 2: C6.2 92.71,36.83 92.71,39.37 T4.T1 92.71,40.64 92.71,46.99 DIM3.2
N$35
  Top 2: R17.P$1 98.16,33.92 95.89,35.56 95.89,37.41 95.88,37.42 T4.T2 95.89,43.5 98.42,46.03 DIM3.1
N$36
  Top 0.406: R18.2 95.88,21.99 OK5.1
N$37
  Bottom 0.406: OK6.4 115.57,27.94 115.57,39.37 113.03,39.37 T5.G
N$38
  Bottom 0.406: OK6.6 111.76,27.94 111.76,30.48 113.03,30.48 R19.P$2
N$39
  Top 0.406: 104.14,33.02 104.14,35.56 C7.1 | 104.14,33.02 104.14,30.48 R19.P$1 | 104.14,33.02 R20.P$2
N$40
  Top 2: C7.2 107.95,35.56 107.95,39.37 T5.T1 107.95,40.64 107.95,46.99 DIM4.2
N$41
  Top 2: DIM4.1 113.03,46.99 113.03,43.18 110.49,40.64 T5.T2 110.49,39.37 110.49,38.1 111.76,36.83 111.76,34.29 113.03,33.02 R20.P$1
N$42
  Top 0.406: R21.2 111.12,21.99 OK6.1
N$43
  Bottom 0.406: OK7.4 132.08,27.94 132.08,38.1 129.54,38.1 T6.G
N$44
  Bottom 0.406: OK7.6 127,27.94 127,30.48 129.54,30.48 R22.P$2
N$45
  Top 0.406: 119.38,33.02 119.38,35.56 C8.1 | 119.38,33.02 119.38,30.48 R22.P$1 | 119.38,33.02 R23.P$2
N$46
  Top 2: C8.2 124.46,35.56 124.46,38.1 T6.T1 124.46,39.37 124.46,46.99 DIM5.2
N$47
  Top 2: DIM5.1 128.27,46.99 127,45.72 127,39.37 T6.T2 127,34.29 128,33.29 R23.P$1
N$48
  Top 0.406: R24.2 126.36,21.99 OK7.1
N$49
  Bottom 0.406: R7.P$2 125.73,8.89 128.27,11.43 130.81,11.43 ZERODETECT.2
N$50
  Top 0.406: R8.P$2 125.73,13.97 130.81,8.89 130.81,7.62 ZERODETECT.1
N$52  (via drill 0.6)
  Top 0.406: v32.68,21.27 IC1.10 | U$1.6 24.78,19.7 v25.72,20.64
  Bottom 0.406: v32.68,21.27 32.38,21.59 30.16,21.59 29.53,20.95 26.04,20.95 v25.72,20.64
N$59
  Top 0.406: R28.2 34.29,46.99 34.29,44.45 IC3.4
N$60
  Top 0.406: R27.1 40.64,41.91 36.83,41.91 35.56,43.18 IC3.3
U1RX  (via drill 0.6)
  Top 0.406: U$2.6 91.12,8.39 91.12,8.57 v90.49,8.57 | v36.51,23.81 36.49,24.79 IC1.2 | v40.64,15.24 v40.64,17.14
  Bottom 0.406: v90.49,8.57 88.9,8.57 87.31,10.16 73.03,10.16 70.48,12.7 41.59,12.7 40.64,13.65 v40.64,15.24 | v36.51,23.81 36.51,22.86 36.2,22.54 36.2,19.68 40.01,19.68 40.64,19.05 v40.64,17.14
U1RXP  (via drill 0.6)
  Top 0.406: U$2.18 94.3,15.41 v94.3,15.56 | v37.15,21.59 36.49,20.93 IC1.13 36.49,17.25 R31.2
  Bottom 0.406: v37.15,21.59 38.1,21.59 39.37,22.54 57.15,22.54 64.14,15.88 71.12,15.88 74.3,12.7 89.22,12.7 90.17,11.75 92.08,11.75 92.71,12.38 94.3,13.65 v94.3,15.56
U1TX  (via drill 0.6)
  Top 0.406: U$2.16 95.57,14.17 v95.57,15.56 | v32.7,30.48 32.68,30.46 IC1.5
  Bottom 0.406: v95.57,15.56 86.36,24.45 39.37,24.45 33.34,30.48 v32.7,30.48
U1TXP  (via drill 0.6)
  Top 0.406: IC1.8 30.16,18.45 30.16,18.41 31.24,17.34 R32.2 31.24,14.88 31.43,14.69 v31.43,14.29 | v61.91,14.61 60.96,15.56 49.53,15.56 v48.26,14.29 | v36.51,11.75 39.05,14.29 v44.45,14.29 | 93.66,13.97 93.66,14.05 U$2.19 93.7,11.15 v93.66,11.11
  Bottom 0.406: v93.66,11.11 93.03,10.48 89.53,10.48 88.58,11.43 73.66,11.43 70.48,14.61 v61.91,14.61 | v31.43,14.29 31.43,13.34 33.34,11.75 v36.51,11.75 | v44.45,14.29 v48.26,14.29
U2RX  (via drill 0.6)
  Top 0.406: v33.34,8.89 33.34,2.86 34.61,1.59 71.44,1.59 72.39,0.64 83.55,0.64 ICSP.5 87.36,4.76 89.53,4.76 90.45,5.67 U$2.5 | 36.92,46.04 36.81,45.93 36.81,45.72 | 36.81,45.72 IC3.2 | 36.81,45.72 36.83,45.72 v36.83,46.04
  Bottom 0.406: v36.83,46.04 35.56,46.99 28.26,46.99 26.99,48.26 20,48.26 19.05,47.31 19.05,14.92 22.54,11.11 31.11,11.11 v33.34,8.89
U2RXP  (via drill 0.6)
  Top 0.406: 36.83,35.24 36.83,37.78 IC3.13 | U$2.15 96.2,14.18 96.2,14.92 97.47,14.92 v97.47,15.24 | 36.83,35.24 R2.2 | v36.83,33.34 36.83,35.24
  Bottom 0.406: v97.47,15.24 95.89,16.83 95.25,16.83 86.36,25.4 46.99,25.4 46.99,26.04 46.35,26.35 40.32,26.35 36.83,29.84 v36.83,33.34
U2TX  (via drill 0.6)
  Top 0.406: IC3.5 33.02,44.36 v33.02,46.04 | v34.61,8.57 34.61,3.17 35.56,2.22 72.07,2.22 73.03,1.27 82.55,1.27 83.19,1.92 ICSP.4 83.19,4.45 83.84,5.42 86.68,5.42 87.31,5.4 89.22,5.4 89.8,5.98 U$2.4
  Bottom 0.406: v33.02,46.04 28.26,46.04 26.67,47.62 20.64,47.62 19.68,46.35 19.68,15.24 22.86,11.75 32.38,11.75 34.61,9.53 v34.61,8.57
U2TXP  (via drill 0.6)
  Top 0.406: IC3.8 30.48,38.1 30.48,35.2 R25.2 30.59,32.5 v31.11,32.07 | U$2.17 94.93,14.02 v94.93,12.7 | v45.4,25.4 v45.4,21.59
  Bottom 0.406: v94.93,12.7 94.3,12.06 93.34,12.06 92.39,11.11 89.85,11.11 88.9,12.06 73.98,12.06 70.8,15.24 63.5,15.24 56.83,21.59 v45.4,21.59 | v45.4,25.4 40.32,25.4 33.66,32.07 v31.11,32.07
VCC  (via drill 0.6)
  Top 0.406: C13.1 65.63,3.99 U2-3V3.1 65.03,9.84 63.82,9.84 62.23,11.43 62.23,13.02 61.27,13.97 C14.1 | U4-5V.1 75.56,9.64 75.56,8.26 74.3,6.99 v71.75,6.99
  Bottom 0.406: v71.75,6.99 69.53,4.76 69.53,2.86 68.9,1.91 66.04,1.91 65.4,2.54 C13.1 64.77,3.81 60.96,7.62 29.21,7.62 POWER.PWR

### Text on the board
tNames: DMX IN | DMX OUT
bNames: AC Controller Board v0.3.1 | Design by Isaac Gutekunst / isaac.cc